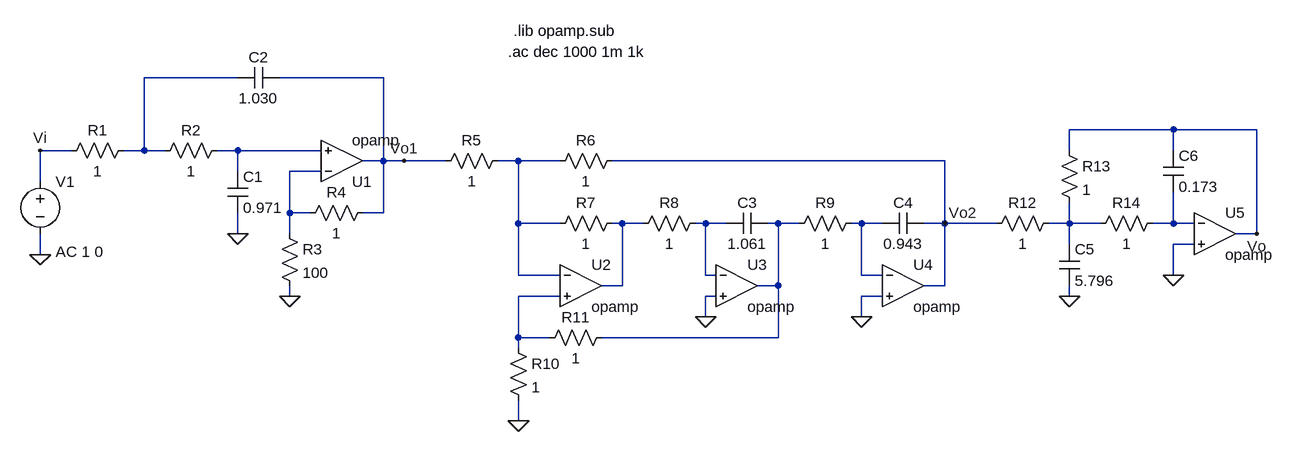
[diagram p0: schematic butterwoth_orden6_SKKHNMFB.asc]
butterwoth_orden6_SKKHNMFB.asc, the LTspice schematic file:
Version 4.1
SHEET 1 2040 680
WIRE 400 32 256 32
WIRE 624 32 464 32
WIRE 1840 112 1680 112
WIRE 1968 112 1840 112
WIRE 144 144 96 144
WIRE 256 144 256 32
WIRE 256 144 224 144
WIRE 288 144 256 144
WIRE 400 144 368 144
WIRE 528 144 400 144
WIRE 1680 144 1680 112
WIRE 1840 144 1840 112
WIRE 624 160 624 32
WIRE 624 160 592 160
WIRE 656 160 624 160
WIRE 720 160 656 160
WIRE 832 160 800 160
WIRE 896 160 832 160
WIRE 1488 160 976 160
WIRE 400 176 400 144
WIRE 528 176 480 176
WIRE 96 192 96 144
WIRE 480 240 480 176
WIRE 512 240 480 240
WIRE 624 240 624 160
WIRE 624 240 592 240
WIRE 832 256 832 160
WIRE 896 256 832 256
WIRE 992 256 976 256
WIRE 1024 256 992 256
WIRE 1120 256 1104 256
WIRE 1152 256 1120 256
WIRE 1232 256 1216 256
WIRE 1264 256 1232 256
WIRE 1360 256 1344 256
WIRE 1392 256 1360 256
WIRE 1488 256 1488 160
WIRE 1488 256 1456 256
WIRE 1568 256 1488 256
WIRE 1680 256 1680 224
WIRE 1680 256 1648 256
WIRE 1728 256 1680 256
WIRE 1840 256 1840 208
WIRE 1840 256 1808 256
WIRE 1872 256 1840 256
WIRE 400 272 400 240
WIRE 480 272 480 240
WIRE 1968 272 1968 112
WIRE 1968 272 1936 272
WIRE 1680 288 1680 256
WIRE 1872 288 1840 288
WIRE 96 304 96 272
WIRE 832 336 832 256
WIRE 896 336 832 336
WIRE 1120 336 1120 256
WIRE 1136 336 1120 336
WIRE 1360 336 1360 256
WIRE 1392 336 1360 336
WIRE 1840 336 1840 288
WIRE 992 352 992 256
WIRE 992 352 960 352
WIRE 1232 352 1232 256
WIRE 1232 352 1200 352
WIRE 1488 352 1488 256
WIRE 1488 352 1456 352
WIRE 480 368 480 352
WIRE 896 368 832 368
WIRE 1136 368 1120 368
WIRE 1392 368 1360 368
WIRE 1680 368 1680 352
WIRE 1120 400 1120 368
WIRE 1360 400 1360 368
WIRE 832 432 832 368
WIRE 880 432 832 432
WIRE 1232 432 1232 352
WIRE 1232 432 960 432
WIRE 832 448 832 432
WIRE 832 560 832 528
FLAG 400 272 0
FLAG 96 304 0
FLAG 96 144 Vi
FLAG 656 160 Vo1
FLAG 480 368 0
FLAG 832 560 0
FLAG 1120 400 0
FLAG 1360 400 0
FLAG 1840 336 0
FLAG 1680 368 0
FLAG 1968 272 Vo
FLAG 1488 256 Vo2
SYMBOL voltage 96 176 R0
WINDOW 123 24 124 Left 2
WINDOW 39 0 0 Left 0
SYMATTR InstName V1
SYMATTR Value ""
SYMATTR Value2 AC 1 0
SYMBOL res 240 128 R90
WINDOW 0 0 56 VBottom 2
WINDOW 3 32 56 VTop 2
SYMATTR InstName R1
SYMATTR Value 1
SYMBOL res 384 128 R90
WINDOW 0 0 56 VBottom 2
WINDOW 3 32 56 VTop 2
SYMATTR InstName R2
SYMATTR Value 1
SYMBOL cap 384 176 R0
SYMATTR InstName C1
SYMATTR Value 0.971
SYMBOL res 464 256 R0
SYMATTR InstName R3
SYMATTR Value 100
SYMBOL res 608 224 R90
WINDOW 0 0 56 VBottom 2
WINDOW 3 32 56 VTop 2
SYMATTR InstName R4
SYMATTR Value 1
SYMBOL OpAmps\\opamp 560 224 M180
SYMATTR InstName U1
SYMBOL cap 464 16 R90
WINDOW 0 0 32 VBottom 2
WINDOW 3 32 32 VTop 2
SYMATTR InstName C2
SYMATTR Value 1.030
SYMBOL res 816 144 R90
WINDOW 0 0 56 VBottom 2
WINDOW 3 32 56 VTop 2
SYMATTR InstName R5
SYMATTR Value 1
SYMBOL res 992 144 R90
WINDOW 0 0 56 VBottom 2
WINDOW 3 32 56 VTop 2
SYMATTR InstName R6
SYMATTR Value 1
SYMBOL res 992 240 R90
WINDOW 0 0 56 VBottom 2
WINDOW 3 32 56 VTop 2
SYMATTR InstName R7
SYMATTR Value 1
SYMBOL res 1120 240 R90
WINDOW 0 0 56 VBottom 2
WINDOW 3 32 56 VTop 2
SYMATTR InstName R8
SYMATTR Value 1
SYMBOL cap 1216 240 R90
WINDOW 0 0 32 VBottom 2
WINDOW 3 32 32 VTop 2
SYMATTR InstName C3
SYMATTR Value 1.061
SYMBOL res 1360 240 R90
WINDOW 0 0 56 VBottom 2
WINDOW 3 32 56 VTop 2
SYMATTR InstName R9
SYMATTR Value 1
SYMBOL cap 1456 240 R90
WINDOW 0 0 32 VBottom 2
WINDOW 3 32 32 VTop 2
SYMATTR InstName C4
SYMATTR Value 0.943
SYMBOL OpAmps\\opamp 928 288 R0
SYMATTR InstName U2
SYMBOL res 816 432 R0
SYMATTR InstName R10
SYMATTR Value 1
SYMBOL res 976 416 R90
WINDOW 0 0 56 VBottom 2
WINDOW 3 32 56 VTop 2
SYMATTR InstName R11
SYMATTR Value 1
SYMBOL OpAmps\\opamp 1168 288 R0
SYMATTR InstName U3
SYMBOL OpAmps\\opamp 1424 288 R0
SYMATTR InstName U4
SYMBOL res 1664 240 R90
WINDOW 0 0 56 VBottom 2
WINDOW 3 32 56 VTop 2
SYMATTR InstName R12
SYMATTR Value 1
SYMBOL cap 1664 288 R0
SYMATTR InstName C5
SYMATTR Value 5.796
SYMBOL res 1664 128 R0
SYMATTR InstName R13
SYMATTR Value 1
SYMBOL res 1824 240 R90
WINDOW 0 0 56 VBottom 2
WINDOW 3 32 56 VTop 2
SYMATTR InstName R14
SYMATTR Value 1
SYMBOL cap 1824 144 R0
SYMATTR InstName C6
SYMATTR Value 0.173
SYMBOL OpAmps\\opamp 1904 208 R0
SYMATTR InstName U5
TEXT 824 -40 Left 2 !.lib opamp.sub
TEXT 816 -8 Left 2 !.ac dec 1000 1m 1k

The netlist it stands for:
* butterwoth_orden6_SKKHNMFB.asc
V1 Vi 0 AC 1 0
R1 N001 Vi 1
R2 N002 N001 1
C1 N002 0 0.971
R3 N004 0 100
R4 Vo1 N004 1
X§U1 N004 N002 Vo1 opamp Aol=100K GBW=10Meg  ; pins invin noninvin out
C2 Vo1 N001 1.030
R5 N003 Vo1 1
R6 Vo2 N003 1
R7 N005 N003 1
R8 N006 N005 1
C3 N007 N006 1.061
R9 N008 N007 1
C4 Vo2 N008 0.943
X§U2 N003 N011 N005 opamp Aol=100K GBW=10Meg  ; pins invin noninvin out
R10 N011 0 1
R11 N007 N011 1
X§U3 N006 0 N007 opamp Aol=100K GBW=10Meg  ; pins invin noninvin out
X§U4 N008 0 Vo2 opamp Aol=100K GBW=10Meg  ; pins invin noninvin out
R12 N009 Vo2 1
C5 N009 0 5.796
R13 Vo N009 1
R14 N010 N009 1
C6 Vo N010 0.173
X§U5 N010 0 Vo opamp Aol=100K GBW=10Meg  ; pins invin noninvin out
.lib opamp.sub
.ac dec 1000 1m 1k
.backanno
.end